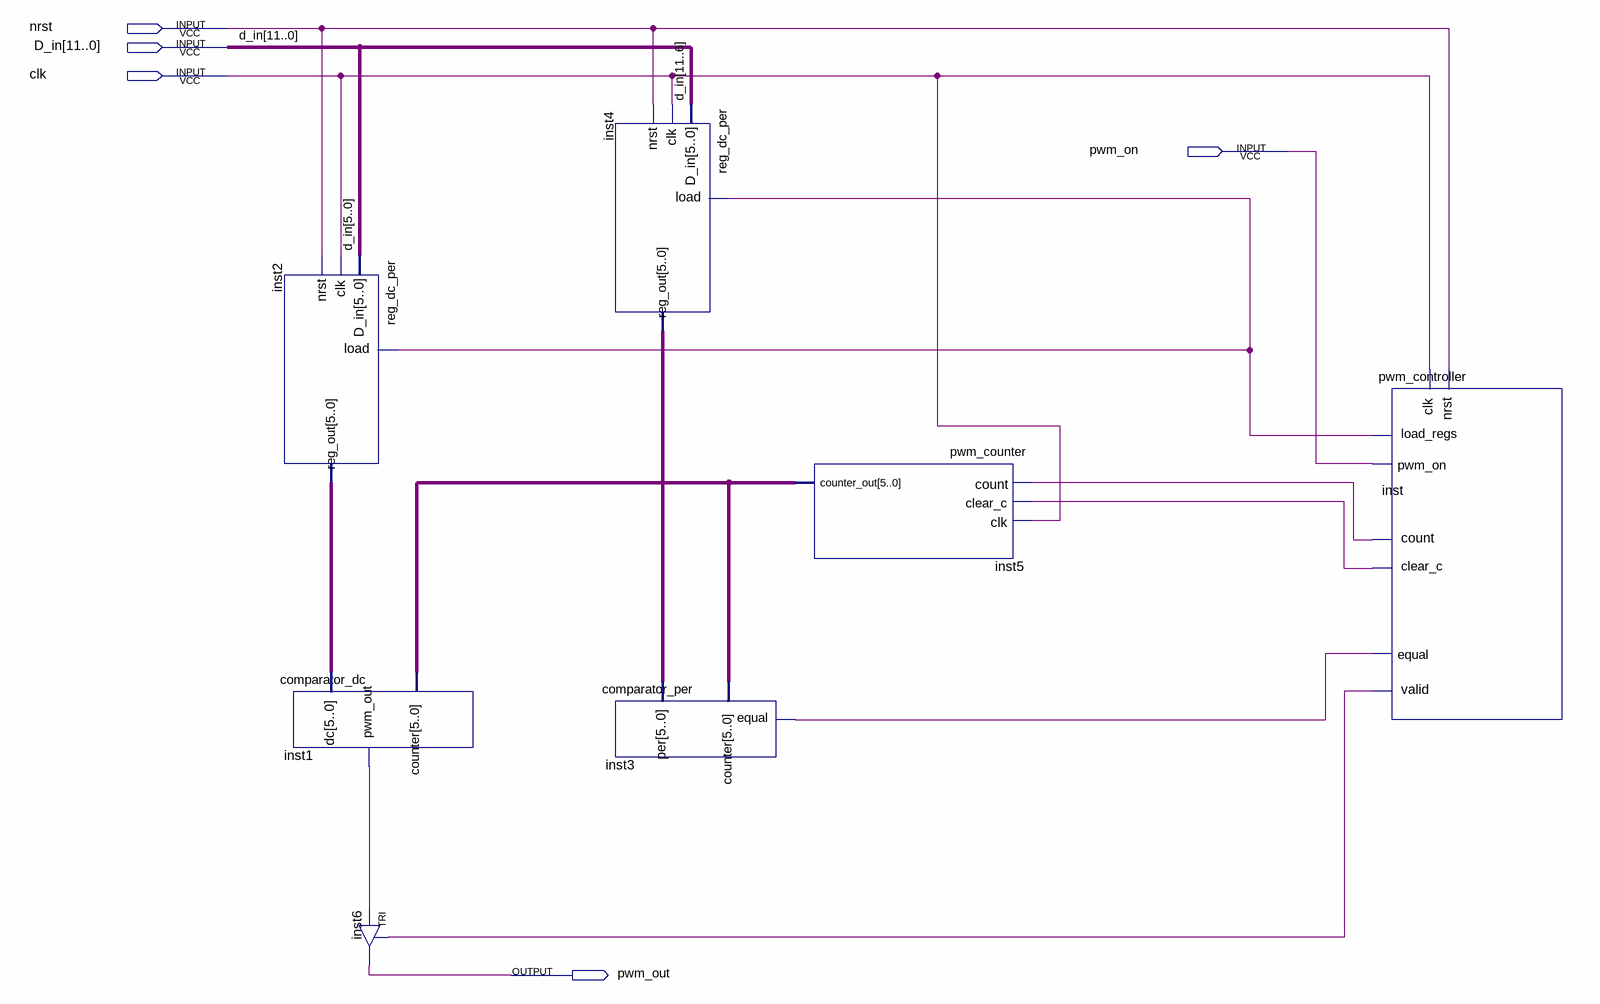
[diagram p0: schematic sheet]
// Quartus schematic pwm_generator.bdf as structural Verilog: 7 symbols, 5 pins
module pwm_generator (
  input  nrst,
  input  [11:0] D_in,
  input  clk,
  input  pwm_on,
  output pwm_out
);

  wire inst1_pwm_out, inst3_equal, inst_clear_c, inst_count, inst_load_regs, inst_valid;
  wire [5:0] inst2_reg_out, inst4_reg_out, inst5_counter_out;

  reg_dc_per inst2 (.D_in(D_in[5:0]), .clk(clk), .load(inst_load_regs), .nrst(nrst), .reg_out(inst2_reg_out));
  comparator_dc inst1 (.dc(inst2_reg_out), .counter(inst5_counter_out), .pwm_out(inst1_pwm_out));
  TRI inst6 (.IN(inst1_pwm_out), .OE(inst_valid), .OUT(pwm_out));
  reg_dc_per inst4 (.D_in(D_in[11:6]), .clk(clk), .load(inst_load_regs), .nrst(nrst), .reg_out(inst4_reg_out));
  comparator_per inst3 (.per(inst4_reg_out), .counter(inst5_counter_out), .equal(inst3_equal));
  pwm_counter inst5 (.count(inst_count), .clear_c(inst_clear_c), .clk(clk), .counter_out(inst5_counter_out));
  pwm_controller inst (
    .nrst(nrst), .clk(clk), .equal(inst3_equal), .pwm_on(pwm_on), .valid(inst_valid),
    .load_regs(inst_load_regs), .count(inst_count), .clear_c(inst_clear_c));
endmodule
